# EAGLE schematic board (EAGLE 9.6.2)
CNAME: JTAG adapter board; CREVISION: V1.5
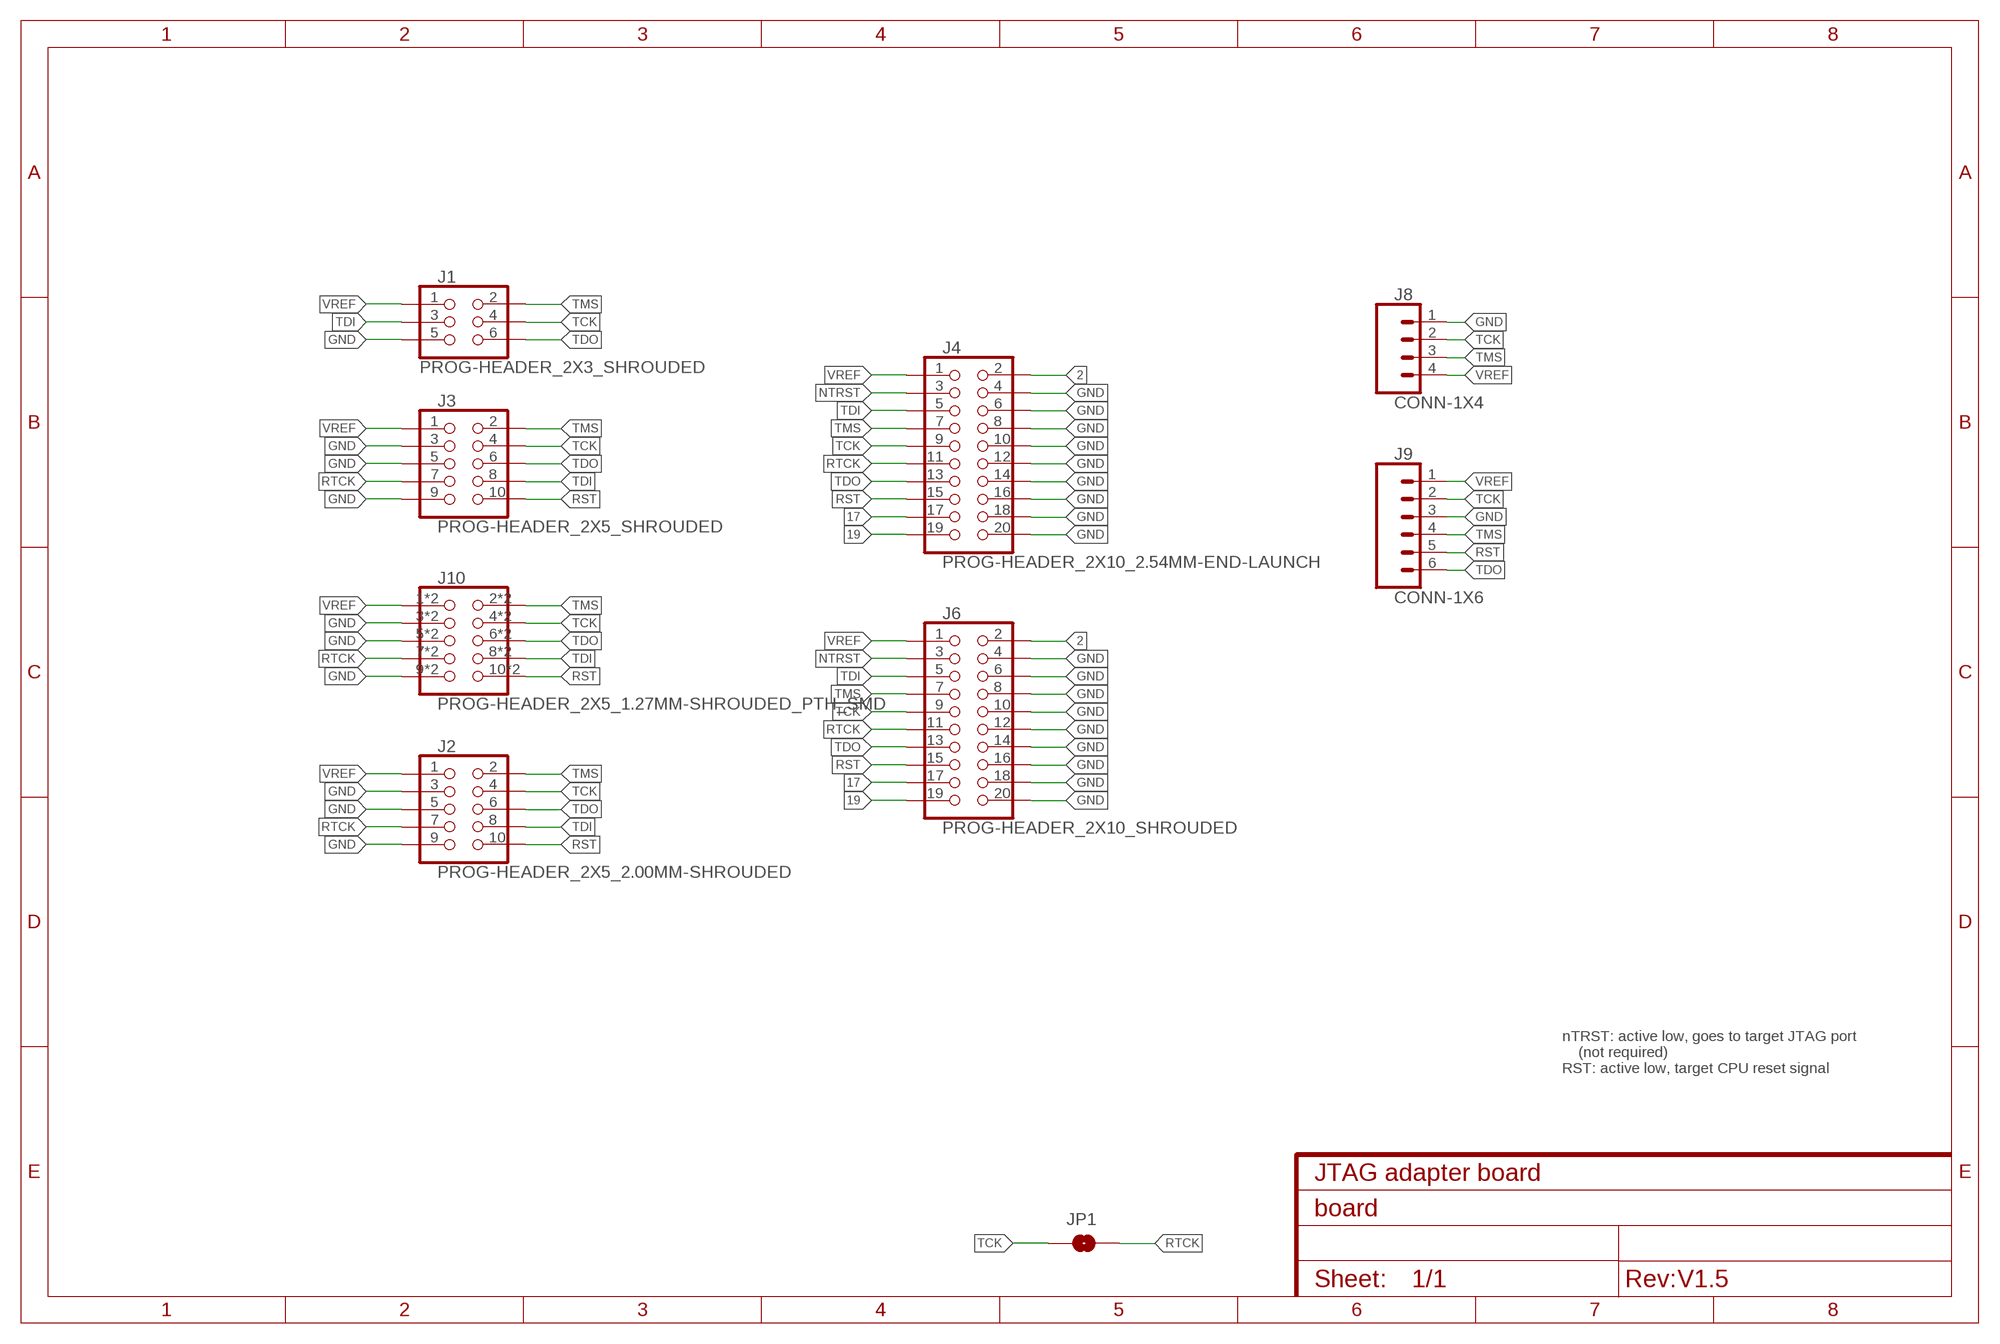
[diagram p0: schematic, sheet 1]

## Parts
J1  PROG-HEADER_2X3_SHROUDED  [2X3-2.54MM-SHROUDED]
J2  PROG-HEADER_2X5_2.00MM-SHROUDED  [2X5-2.00MM-SHROUDED]
J3  PROG-HEADER_2X5_SHROUDED  [2X5-2.54MM-SHROUDED]
J4  PROG-HEADER_2X10_2.54MM-END-LAUNCH  [2X10-2.54MM-END-LAUNCH]
J6  PROG-HEADER_2X10_SHROUDED  [2X10-2.54MM-SHROUDED]
J8  CONN-1X4  [MOLEX-1X4-2.54MM]
J9  CONN-1X6  [MOLEX-1X6-2.54MM]
J10  PROG-HEADER_2X5_1.27MM-SHROUDED_PTH_SMD  [2X5-1.27MM-SHROUDED_PTH+SMD]
JP1  TCK-RTCK  JUMPER-SMT_2_NO_SILK  [SMT-JUMPER_2_NO_SILK]

## Nets
2: J4.2 J6.2
17: J4.17 J6.17
19: J4.19 J6.19
GND: J1.5 J2.3 J2.5 J2.9 J3.3 J3.5 J3.9 J4.4 J4.6 J4.8 J4.10 J4.12 J4.14 J4.16 J4.18 J4.20 J6.4 J6.6 J6.8 J6.10 J6.12 J6.14 J6.16 J6.18 J6.20 J8.1 J9.3 J10.3 J10.5 J10.9 J10.13 J10.15 J10.19
NTRST: J4.3 J6.3
RST: J2.10 J3.10 J4.15 J6.15 J9.5 J10.10 J10.20
RTCK: J2.7 J3.7 J4.11 J6.11 J10.7 J10.17 JP1.2
TCK: J1.4 J2.4 J3.4 J4.9 J6.9 J8.2 J9.2 J10.4 J10.14 JP1.1
TDI: J1.3 J2.8 J3.8 J4.5 J6.5 J10.8 J10.18
TDO: J1.6 J2.6 J3.6 J4.13 J6.13 J9.6 J10.6 J10.16
TMS: J1.2 J2.2 J3.2 J4.7 J6.7 J8.3 J9.4 J10.2 J10.12
VREF: J1.1 J2.1 J3.1 J4.1 J6.1 J8.4 J9.1 J10.1 J10.11

## Notes on the sheet
- nTRST: active low, goes to target JTAG port
      (not required)
  RST: active low, target CPU reset signal

## Library data of the parts
J1 = angrypig7-Connectors-Programming:PROG-HEADER_2X3
J2 J10 = angrypig7-Connectors-Programming:PROG-HEADER_2X5
J3 = angrypig7-Connectors-Programming:PROG-HEADER_2X5; PROD_ID: CONN-08671; SF_ID: PRT-08506
J4 J6 = angrypig7-Connectors-Programming:PROG-HEADER_2X10
J8 = angrypig7-Connectors-Programming:CONN-1X4
J9 = angrypig7-Connectors-Programming:CONN-1X6
JP1 = angrypig7-Jumpers:JUMPER-SMT_2_NO: Normally open jumper This jumper has two pads in close proximity to each other. Apply solder to close the connection. Round pads are easier to solder for beginners, but are a lot larger. SparkFun Product that uses the round pads: SparkFun EL Sequencer <https://www.sparkfun.com/products/12781>

## Net classes
0 default: width 0.254 mm